# EAGLE design S20210020251_EP (EAGLE 9.6.2)
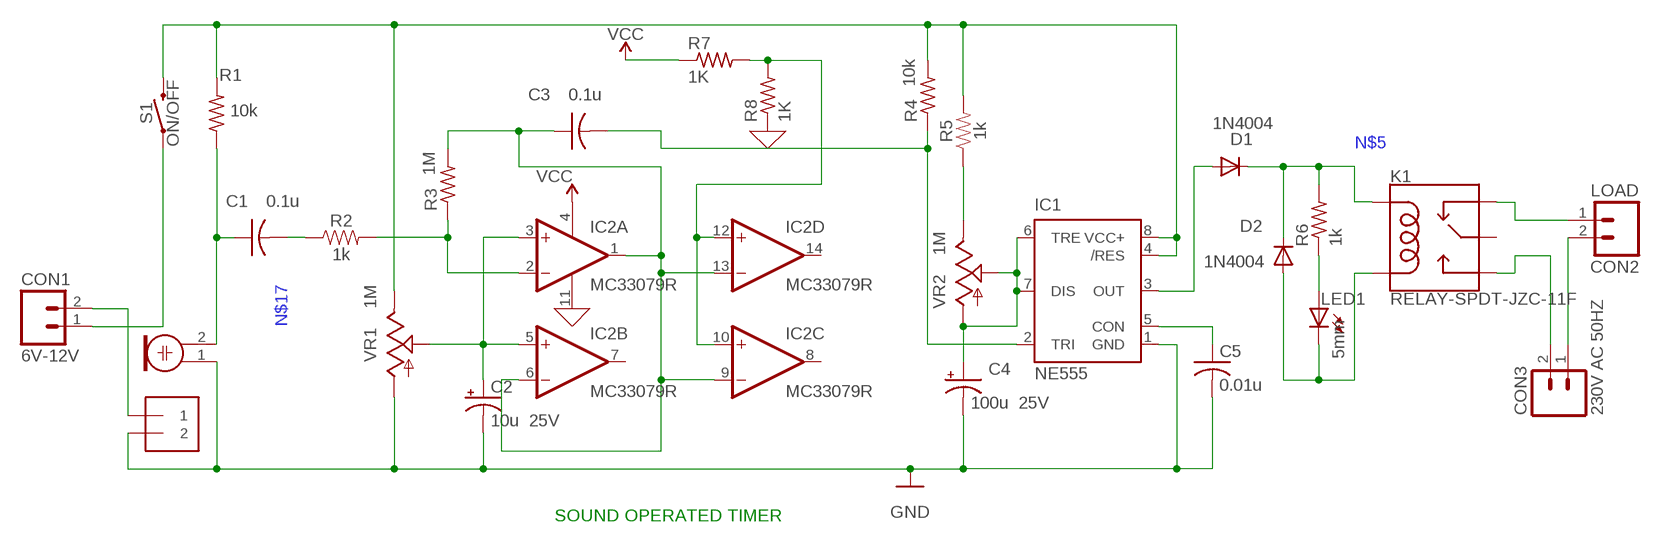
[diagram p0: schematic, sheet 1]

## Parts
C1  0.1u  C-US025-024X044  [C025-024X044]
C2  10u 25V  CPOL-USE2-5  [E2-5]
C3  0.1u  C-US025-024X044  [C025-024X044]
C4  100u 25V  CPOL-USE3.5-8  [E3,5-8]
C5  0.01u  C-US025-024X044  [C025-024X044]
CON1  6V-12V  M02  [02P]
CON2  LOAD  M02  [02P]
CON3  230V AC 50HZ  M02  [02P]
D1  1N4004  [DO41-10]
D2  1N4004  [DO41-10]
IC1  NE555  [DIL-08]
IC2  MC33079R  AD8684R  [SO14]
J1  1X2-3.5MM  [1X2-3.5MM]
K1  RELAY-SPDT-JZC-11F  [RELAY-JZC]
LED1  5mm  LED5MM  [LED5MM]
M1  ELECTRET_MICROPHON-F6035AP  [F6035AP]
R1  10k  R-US_0204/2V  [0204V]
R2  1k  1KOHM-0402T-1/16W-1%  [0402-TIGHT]
R3  1M  R-US_0204/2V  [0204V]
R4  10k  R-US_0204/2V  [0204V]
R5  1k  1KOHM-0402T-1/16W-1%  [0402-TIGHT]
R6  1k  R-US_0204/2V  [0204V]
R7  1K  R-US_0204/2V  [0204V]
R8  1K  R-US_0204/2V  [0204V]
S1  ON/OFF  MOMENTARY-SWITCH-SPST-PTH-6.0MM  [TACTILE_SWITCH_PTH_6.0MM]
VR1  1M  US-EVUE2A  [EVUE]
VR2  1M  TRIM_US-B64Y  [B64Y]

## Nets
0: IC2.11(P:V-) R8.1 ; supply symbol labelled GND
GND: C2.- C4.- C5.2 IC1.1(GND) J1.2 M1.1 VR1.1(A)
N$1: CON2.1 K1.2(NC)
N$2: LED1.A R6.1
N$3: CON1.2 J1.1
N$4: D1.A IC1.3(OUT)
N$5: D1.C D2.C K1.5(COIL1) R6.2
N$6: CON2.2 CON3.1
N$7: CON1.1 S1.1
N$8: D2.A K1.1(COIL2) LED1.K(C)
N$9: C5.1 IC1.5(CON)
N$10: C4.+ IC1.6(TRE) IC1.7(DIS) VR2.A VR2.S
N$11: C3.2 IC1.2(TRI) R4.1
N$12: C2.+ IC2.3(A:+IN) IC2.5(B:+IN) VR1.2(S)
N$13: R5.1 VR2.E
N$14: IC2.2(A:-IN) R2.2 R3.1
N$15: IC1.4(/RES) IC1.8(VCC+) R1.2 R4.2 R5.2 S1.3 VR1.3(E)
N$16: C1.2 R2.1
N$17: C1.1 M1.2 R1.1
N$18: CON3.2 K1.3(NO)
N$19: C3.1 IC2.1(A:OUT) IC2.6(B:-IN) IC2.9(C:-IN) IC2.13(D:-IN) R3.2
N$20: IC2.10(C:+IN) IC2.12(D:+IN) R7.2 R8.2
VCC: IC2.4(P:V+) R7.1
Unconnected: IC2.7(B:OUT) IC2.8(C:OUT) IC2.14(D:OUT) K1.4(MAIN)

## Notes on the sheet
- SOUND OPERATED TIMER

## Library data of the parts
C1 C3 C5 = rcl:C-US: CAPACITOR, American symbol; SPICEPREFIX: C
C2 C4 = rcl:CPOL-US: POLARIZED CAPACITOR, American symbol; SPICEPREFIX: C
CON1-CON3 = con-amp-quick:M02: AMP QUICK CONNECTOR; OC_FARNELL: unknown; OC_NEWARK: unknown
D1 D2 = adafruit:1N4004: DIODE General purpose 1N400x type rectifier (With bigger pads) http://www.ladyada.net/library/pcb/eaglelibrary.html
IC1 = st-microelectronics:NE555: General purpose bipolar Timer; MF: Arrow Electronics; MPN: NE555N; OC_FARNELL: 1467742; OC_NEWARK: 89K1486
IC2 = linear:AD8684: Quad Low Power, High Speed JFET Operational Amplifiers Source: http://www.analog.com/UploadedFiles/Data_Sheets/AD8682_8684.pdf
J1 = adafruit:1X2: 3.5mm Terminal block http://www.ladyada.net/library/pcb/eaglelibrary.html
K1 = SparkFun-Electromechanical:RELAY-SPDT: SPDT Electromechanical Relay Single-pole, double-throw sealed relays. When current is applied to the coil, it throws a simple changeover switch, terminating the connection from the NC contact to ground and closing the NO contact. Use them to switch high voltage/high current devices. SparkFun Products JQX-15F: Relay SPDT Sealed - 20A <https://www.sparkfun.com/products/10924> (COM-10924) JZC-11F: Relay SPDT Sealed <https://www.sparkfun.com/products/100> (COM-00100); PROD_ID: COMP-09533; SF_SKU: COM-00100
LED1 = adafruit:LED: LED OSRAM: - CHIPLED LG R971, LG N971, LY N971, LG Q971, LY Q971, LO R971, LY R971 LH N974, LH R974 LS Q976, LO Q976, LY Q976 LO Q996 - Hyper CHIPLED LW Q18S LB Q993, LB Q99A, LB R99A - SideLED LS A670, LO A670, LY A670, LG A670, LP A670 LB A673, LV A673, LT A673, LW A673 LH A674 LY A675 LS A676, LA A676, LO A676, LY A676, LW A676 LS A679, LY A679, LG A679 - Hyper Micro SIDELED® LS Y876, LA Y876, LO Y876, LY Y876 LT Y87S - SmartLED LW L88C, LW L88S LB L89C, LB L89S, LG L890 LS L89K, LO L89K, LY L89K LS L896, LA L896, LO L896, LY L896 - TOPLED LS T670, LO T670, LY T670, LG T670, LP T670 LSG T670, LSP T670, LSY T670, LOP T670, LYG T670 LG T671, LOG T671, LSG T671 LB T673, LV T673, LT T673, LW T673 LH T674 LS T676, LA T676, LO T676, LY T676, LB T676, LH T676, LSB T676, LW T676 LB T67C, LV T67C, LT T67C, LS T67K, LO T67K, LY T67K, LW E67C LS E67B, LA E67B, LO E67B, LY E67B, LB E67C, LV E67C, LT E67C LW T67C LS T679, LY T679, LG T679 LS T770, LO T770, LY T770, LG T770, LP T770 LB T773, LV T773, LT T773, LW T773 LH T774 LS E675, LA E675, LY E675, LS T675 LS T776, LA T776, LO T776, LY T776, LB T776 LHGB T686 LT T68C, LB T68C - Hyper Mini TOPLED® LB M676 - Mini TOPLED Santana® LG M470 LS M47K, LO M47K, LY M47K Source: http://www.osram.convergy.de/
M1 = microphon:ELECTRET_MICROPHON-: Electret Condenser Microphone
R1 R3 R4 R6 = rcl:R-US_: RESISTOR, American symbol; SPICEPREFIX: R
R2 R5 = SparkFun-Resistors:1KOHM: 1kΩ resistor A resistor is a passive two-terminal electrical component that implements electrical resistance as a circuit element. Resistors act to reduce current flow, and, at the same time, act to lower voltage levels within circuits. - Wikipedia; PROD_ID: RES-14342
R7 R8 = adafruit:R-US_: RESISTOR, American symbol
S1 = SparkFun-Switches:MOMENTARY-SWITCH-SPST: Momentary Switch (Pushbutton) - SPST Normally-open (NO) SPST momentary switches (buttons, pushbuttons). Variants PTH-12MM - 12mm square, through-hole Momentary Pushbutton Switch - 12mm Square <https://www.sparkfun.com/products/9190> (COM-09190) PTH-6.0MM, PTH-6.0MM-KIT - 6.0mm square, through-hole Mini Pushbutton Switch <https://www.sparkfun.com/products/97> (COM-00097) KIT package intended for soldering kit's - only one side of pads' copper is exposed. PTH-RIGHT-ANGLE-KIT - Right-angle, through-hole Right Angle Tactile Button <https://www.sparkfun.com/products/10791> - Used on SparkFun BigTime Watch Kit <https://www.sparkfun.com/products/11734> SMD-12MM - 12mm square, surface-mount Tactile Button - SMD (12mm) <https://www.sparkfun.com/products/12993> (COM-12993) Used on SparkFun PicoBoard <https://www.sparkfun.com/products/11888> SMD-4.5MM - 4.5mm Square Trackball Switch Used on SparkFun Blackberry Trackballer Breakout <https://www.sparkfun.com/products/13169> SMD-4.6MMX2.8MM - 4.60mm x 2.80mm, surface mount Used on SparkFun Pro Micro - RP2040 <https://www.sparkfun.com/products/17717> SMD-5.2MM, SMD-5.2-REDUNDANT - 5.2mm square, surface-mount Mini Pushbutton Switch - SMD <https://www.sparkfun.com/products/8720> (COM-08720) Used on Arduino Pro Mini <https://www.sparkfun.com/products/11114> REDUNDANT package connects both switch circuits together SMD-6.0X3.5MM - 6.0 x 3.5mm, surface mount Momentary Reset Switch SMD <https://www.sparkfun.com/products/8229> (COM-08229) SMD-6.2MM-TALL - 6.2mm square, surface mount Tactile Button - SMD (6mm) <https://www.sparkfun.com/products/12992> Used on SparkFun Digital Sandbox <https://www.sparkfun.com/products/12651> SMD-RIGHT-ANGLE - Right-angle, surface mount Used on SparkFun Block for Intel® Edison - Arduino <https://www.sparkfun.com/products/13036>; PROD_ID: SWCH-08441; SF_SKU: COM-00097
VR1 = pot:US-EVU: 9 mm Square Rotary Potentiometers Source: Panasonic
VR2 = pot:TRIM_US-: POTENTIOMETER; SPICEPREFIX: J

## Module MC33079
Ports: 

### Library data of the parts

## Board
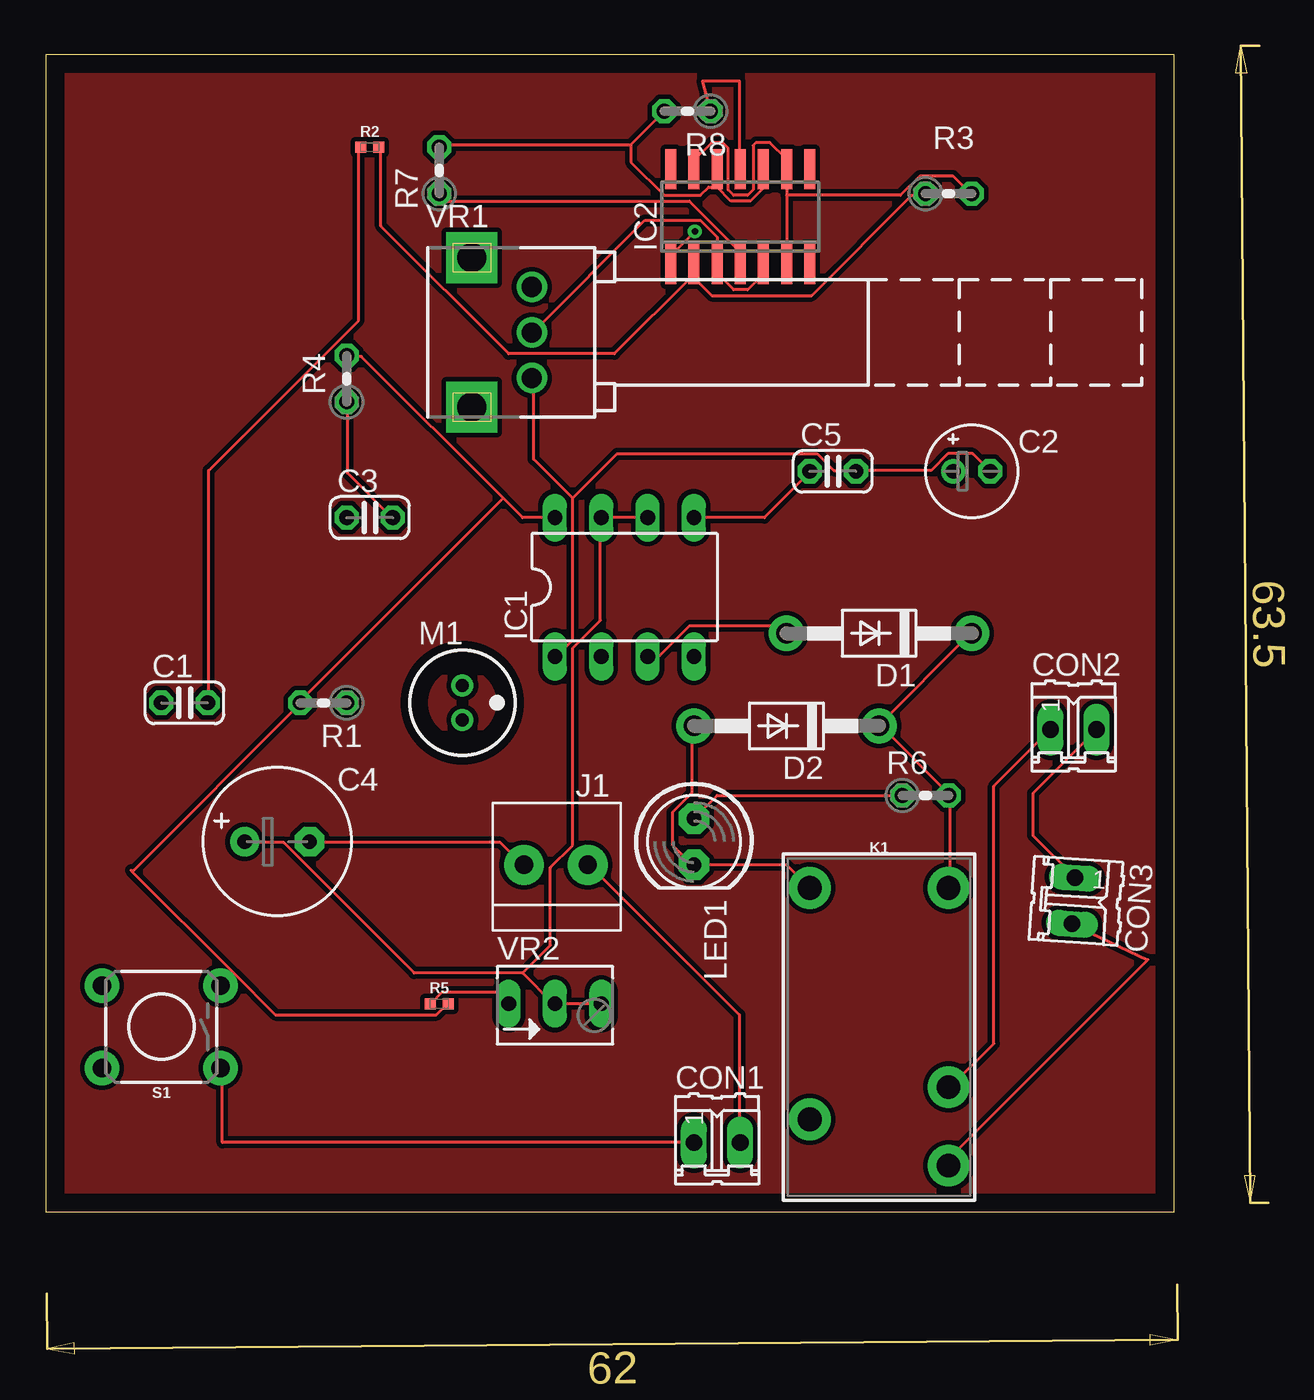
[diagram p1: board, top side]
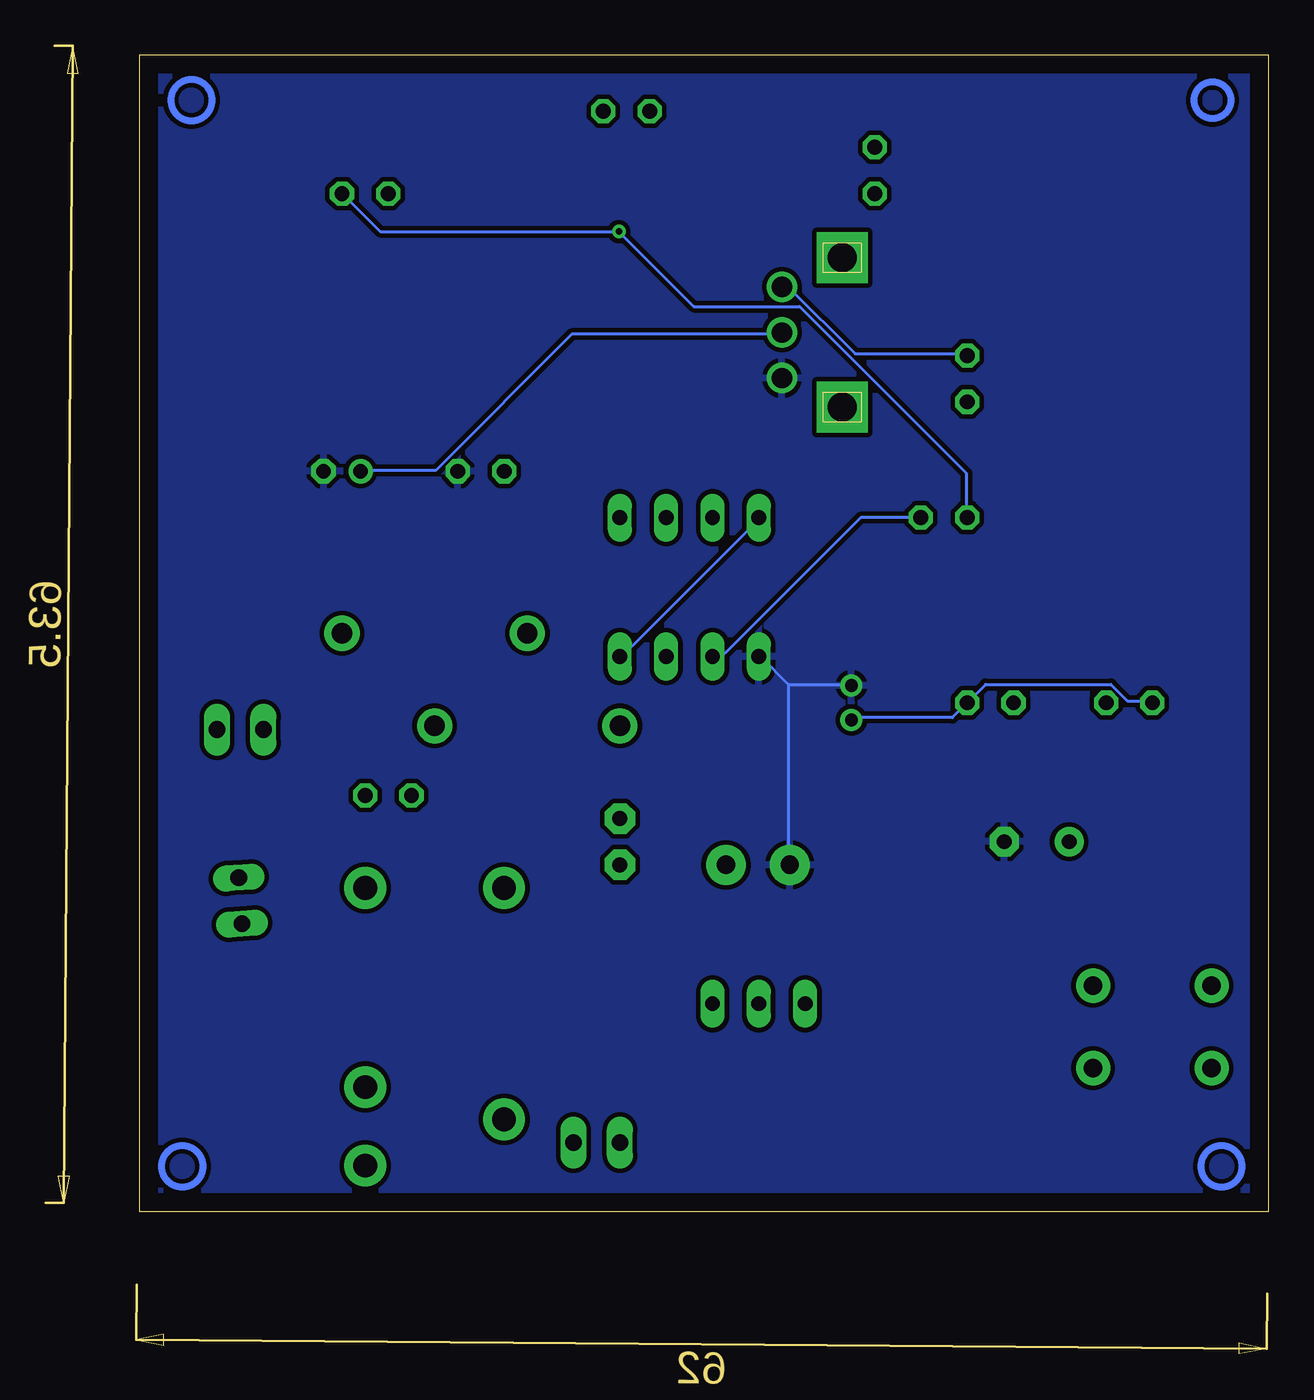
[diagram p2: board, bottom side, seen from below]

Size 61.9 x 63.49 mm. Coordinates in mm from the lower left corner, seen from the top.
Outline: 0,0 61.9,0 61.9,63.49 0,63.49 0,0
Copper layers (1*16): Top 0.035mm / dielectric 1.5mm / Bottom 0.035mm
Design rules "default": minimum track width 6mil, minimum drill 0.35mm, track to track 6mil, track to pad 6mil, pad to pad 6mil, via to via 6mil, smd to smd 6mil, copper to edge 40mil, drill to drill 6mil, minimum pad ring 10mil, minimum via ring 8mil, stop-mask expansion 4mil, vias tented up to drill 0mil, thermal gap 10mil

### Footprints (pad centres in the part's own frame; a part is rotated, then mirrored left to right if it is on the bottom)
C025-024X044 = drill 0.813 octagon: 1 -1.27,0; 2 1.27,0
E2-5 = drill 0.813 pad 1.27: + -1.016,0 | drill 0.813 pad 1.27 octagon: - 1.016,0
E3,5-8 = drill 0.813 pad 1.6: + -1.778,0 | drill 0.813 pad 1.6 octagon: - 1.778,0
02P = drill 0.914 long: 1 -1.27,0; 2 1.27,0
DO41-10 = drill 1.118 pad 1.93: A 5.08,0; C -5.08,0
DIL-08 = drill 0.813 long: 1 -3.81,-3.81; 2 -1.27,-3.81; 3 1.27,-3.81; 4 3.81,-3.81; 5 3.81,3.81; 6 1.27,3.81; 7 -1.27,3.81; 8 -3.81,3.81
SO14 = smd 0.6 x 2.2: 1 -3.81,-2.6; 2 -2.54,-2.6; 3 -1.27,-2.6; 4 0,-2.6; 5 1.27,-2.6; 6 2.54,-2.6; 7 3.81,-2.6; 8 3.81,2.6; 9 2.54,2.6; 10 1.27,2.6; 11 0,2.6; 12 -1.27,2.6; 13 -2.54,2.6; 14 -3.81,2.6
1X2-3.5MM = drill 1 pad 2.184: 1 1.8,0; 2 -1.7,0
RELAY-JZC = drill 1.3 pad 2.286: 1 3.81,-8.89; 2 -3.81,2.032; 3 -3.81,6.35; 4 3.81,3.81; 5 -3.81,-8.89
LED5MM = drill 0.813 pad 1.676 octagon: A -1.27,0; K 1.27,0
F6035AP = drill 0.7 pad 1.2: 1 0,0.95; 2 0,-0.95
0204V = drill 0.813 octagon: 1 -1.27,0; 2 1.27,0
0402-TIGHT = smd 0.6 x 0.6: 1 -0.5,0; 2 0.5,0
TACTILE_SWITCH_PTH_6.0MM = drill 1.016 pad 1.88: 1 -3.251,2.261; 2 3.251,2.261; 3 -3.251,-2.261; 4 3.251,-2.261
EVUE = drill 1.1 pad 1.676: 1 0,-2.5; 2 0,0; 3 0,2.5 | drill 1.6 pad 2.8 square: M1 -3.3,4.1; M2 -3.3,-4.1
B64Y = drill 0.813 long: A 2.54,0; E -2.54,0; S 0,0

### Placement (x,y rotation side)
C1  7.62,27.94 0 top
C2  50.8,40.64 0 top
C3  17.78,38.1 0 top
C4  12.7,20.32 0 top
C5  43.18,40.64 0 top
CON1  36.83,3.81 0 top
CON2  56.38,26.47 0 top
CON3  56.38,17.08 266.1 top
D1  45.72,31.75 180 top
D2  40.64,26.67 180 top
IC1  31.75,34.29 0 top
IC2  38.1,54.61 0 top
J1  27.94,19.05 0 top
K1  45.72,8.89 180 top
LED1  35.56,20.32 270 top
M1  22.86,27.94 0 top
R1  15.24,27.94 180 top
R2  17.78,58.42 0 top
R3  49.53,55.88 0 top
R4  16.51,45.72 90 top
R5  21.59,11.43 0 top
R6  48.26,22.86 0 top
R7  21.59,57.15 90 top
R8  35.2,60.39 180 top
S1  6.35,10.16 180 top
VR1  26.67,48.26 0 top
VR2  27.94,11.43 0 top

### Tracks (layer width: path | path; a pad name or v marks a point on that pad's centre or on a via)
0
  Top 0.152: R8.1 36.04,62.05 38.05,62.05 38.05,57.3 IC2.11
END
  pour Top (isolate 0.254): 0.06,63.5 0.06,0.5 61.56,0.5 62.06,1 62.06,63 61.56,63.5 0.56,63.5
GND
  Top 0.152: C4.- 14.58,20.27 24.94,20.27 26.16,19.05 J1.2 | 44.45,40.69 48.56,40.69 49.48,41.6 50.85,41.6 C2.- | 28.9,39.17 26.77,41.3 26.77,45.72 VR1.1 | 28.9,39.17 28.9,31.39 27.99,30.48 IC1.1 | 44.45,40.69 43.23,40.69 42.32,41.6 31.34,41.6 28.9,39.17 | 44.45,40.69 C5.2
  Bottom 0.152: 26.31,28.96 22.96,28.96 M1.1 | 26.31,28.96 27.84,30.48 IC1.1 | 26.31,28.96 26.31,19.05 J1.2
  pour Bottom (isolate 0.254): 0,63.5 0,0 62.23,0 62.23,63.5
  pour Bottom (isolate 0.254): 0.25,63.08 0.25,0.35 61.22,0.35 61.57,0.7 61.57,63.08 61.22,63.43 -0.1,63.43
N$1
  Top 0.152: CON2.1 52.01,23.37 52.01,9.23 49.63,6.86 K1.2
N$2
  Top 0.152: R6.1 36.83,22.86 LED1.A
N$3
  Top 0.152: CON1.2 38.05,3.81 38.05,10.82 29.82,19.05 J1.1
N$4
  Top 0.152: IC1.3 33.63,30.48 35.31,32.16 40.34,32.16 40.64,31.85 D1.A
N$5
  Top 0.152: 49.63,22.86 49.63,17.83 K1.5 | 49.63,22.86 45.82,26.67 D2.C 45.67,26.67 50.7,31.7 D1.C | 49.63,22.86 R6.2
N$6
  Top 0.152: CON2.2 54.15,22.97 54.15,20.66 CON3.1
N$7
  Top 0.152: CON1.1 9.7,3.81 9.7,7.77 S1.1
N$8
  Top 0.152: K1.1 40.64,19.05 LED1.K 35.46,19.05 34.39,20.12 34.39,21.95 35.46,23.01 35.46,26.67 D2.A
N$9
  Top 0.152: IC1.5 39.42,38.1 41.86,40.54 C5.1
N$10
  Top 0.152: IC1.6 IC1.7 30.43,38.1 30.43,32.46 28.9,30.94 28.9,20.12 27.69,18.9 27.69,14.63 26.16,13.11 | VR2.A VR2.S 27.84,11.43 26.16,13.11 | 26.16,13.11 20.22,13.11 13.06,20.27 10.92,20.27 C4.+
N$11
  Top 0.152: R4.1 16.56,44.35 16.56,40.54 19,38.1 C3.2
  Bottom 0.152: IC1.2 29.97,30.48 22.35,38.1 C3.2
N$12
  Top 0.152: IC2.5 39.27,51.97 39.27,51.36 38.51,50.6 37.74,50.6 36.83,51.51 IC2.3 36.83,53.49 35.92,54.41 32.87,54.41 26.77,48.31 VR1.2
  Bottom 0.152: C2.+ 49.78,40.69 45.67,40.69 38.2,48.16 26.77,48.16 VR1.2
N$13
  Top 0.152: VR2.E 24.79,12.04 21.74,12.04 21.13,11.43 R5.1
N$14
  Top 0.152: 35.46,51.36 31.19,47.09 25.4,47.09 18.39,54.1 18.39,58.37 R2.2 | 35.46,51.36 35.46,51.97 IC2.2 35.46,51.36 | 35.46,51.36 36.53,50.29 42.01,50.29 47.5,55.78 48.26,55.78 R3.1
N$15
  Top 0.152: 10.31,13.11 4.67,18.75 4.83,18.75 13.97,27.89 R1.2 13.97,28.04 25.09,39.17 | 10.31,13.11 12.6,10.82 21.44,10.82 22.05,11.43 R5.2 | 25.09,39.17 26.16,38.1 IC1.8 | 25.09,39.17 17.32,46.94 16.56,46.94 R4.2 | 10.31,13.11 9.7,12.5 S1.3
  Bottom 0.152: R4.2 16.56,47.09 22.66,47.09 26.31,50.75 26.62,50.75 VR1.3 | IC1.4 35.46,30.48 27.84,38.1 IC1.8
N$16
  Top 0.152: R2.1 17.17,58.37 17.17,48.92 8.94,40.69 8.94,28.04 C1.2
N$17
  Bottom 0.152: M1.2 22.81,27.13 17.32,27.13 R1.1 15.49,28.96 8.64,28.96 7.72,28.04 6.35,28.04 C1.1
N$18
  Top 0.152: CON3.2 60.45,13.84 49.53,2.92 K1.3
N$19  (via drill 0.35)
  Top 0.152: IC2.13 35.61,57.3 35.61,57.76 36.53,58.67 37.14,58.67 37.44,58.37 37.44,56.08 37.74,55.78 38.51,55.78 38.81,56.08 38.81,58.52 38.96,58.67 39.73,58.67 40.64,57.76 IC2.9 40.64,55.78 | 40.64,55.78 IC2.6 | v35.61,53.8 34.39,52.58 34.39,52.12 IC2.1 | 40.64,55.78 46.89,55.78 47.95,56.84 49.78,56.84 50.7,55.93 R3.2
  Bottom 0.152: R3.2 48.72,53.8 v35.61,53.8 31.5,49.68 25.71,49.68 16.56,40.54 16.56,38.1 C3.1
N$20
  Top 0.152: IC2.10 39.27,57.15 39.27,56.08 38.66,55.47 37.59,55.47 36.83,56.24 | 32.06,58.52 21.59,58.52 R7.2 | R8.2 32.06,58.52 | 36.83,56.24 IC2.12 | 36.83,56.24 36.37,56.24 35.92,55.78 33.93,55.78 32.11,57.61 32.11,58.52 32.06,58.52
VCC
  Top 0.152: IC2.4 38.05,52.12 38.05,52.73 35.31,55.47 21.89,55.47 21.59,55.78 R7.1
(copper drawn outside any net)
  shapes: Bottom circle x4